# Altium project Melloband.PrjPcb
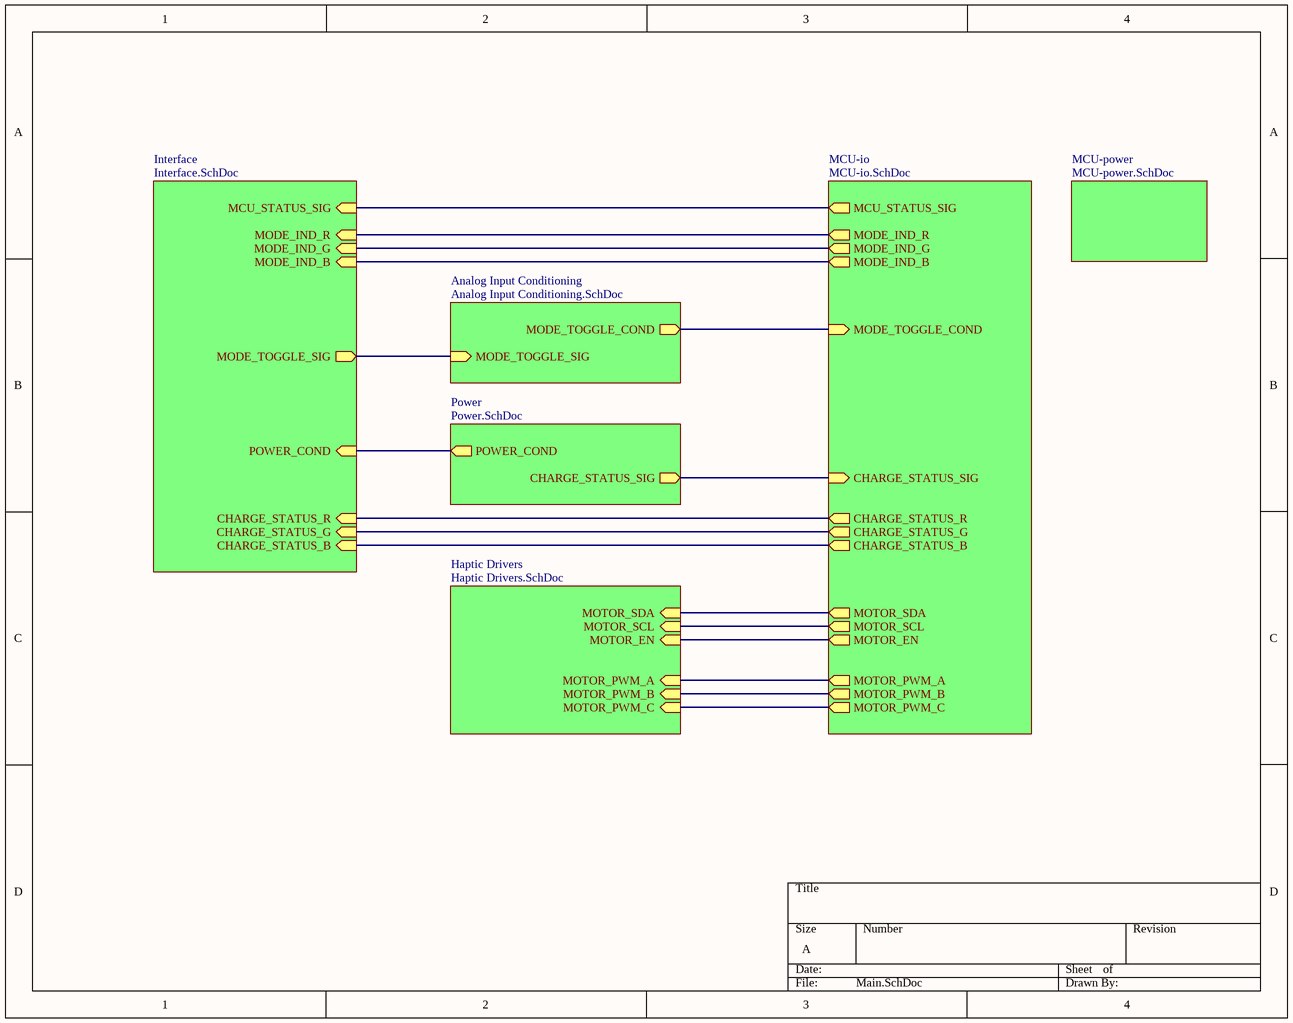
[diagram p0: Main.SchDoc]
7 sheets, 62 parts. Net scope: hierarchical (ports join the sheet entries above them; power ports are global).
Board file: PCB2.PcbDoc
Sheets:
  Main.SchDoc
    MCU-power = MCU-power.SchDoc
    Power = Power.SchDoc
    Analog Input Conditioning = Analog Input Conditioning.SchDoc
    Interface = Interface.SchDoc
    MCU-io = MCU-io.SchDoc
    Haptic Drivers = Haptic Drivers.SchDoc

## Sheet Main.SchDoc
size A; SheetNumber: 1; SheetTotal: 7

### Sub-sheets
Analog Input Conditioning = Analog Input Conditioning.SchDoc: MODE_TOGGLE_SIG (in), MODE_TOGGLE_COND (out)
Haptic Drivers = Haptic Drivers.SchDoc: MOTOR_SDA (in), MOTOR_SCL (in), MOTOR_EN (in), MOTOR_PWM_A (in), MOTOR_PWM_B (in), MOTOR_PWM_C (in)
Interface = Interface.SchDoc: MODE_TOGGLE_SIG (out), CHARGE_STATUS_B (in), MODE_IND_R (in), MCU_STATUS_SIG (in), POWER_COND (in), MODE_IND_G (in), MODE_IND_B (in), CHARGE_STATUS_G (in), CHARGE_STATUS_R (in)
MCU-io = MCU-io.SchDoc: MODE_IND_R (out), MODE_TOGGLE_COND (in), MCU_STATUS_SIG (out), CHARGE_STATUS_SIG (in), CHARGE_STATUS_R (out), MODE_IND_G (out), MODE_IND_B (out), CHARGE_STATUS_G (out), CHARGE_STATUS_B (out), MOTOR_SDA (out), MOTOR_SCL (out), MOTOR_EN (out), MOTOR_PWM_A (out), MOTOR_PWM_B (out), MOTOR_PWM_C (out)
MCU-power = MCU-power.SchDoc: no entries
Power = Power.SchDoc: CHARGE_STATUS_SIG (out), POWER_COND (out)

### Nets
CHARGE_STATUS: sheet Power/CHARGE_STATUS_SIG, sheet MCU-io/CHARGE_STATUS_SIG
CHARGE_STATUS_B: sheet Interface/CHARGE_STATUS_B, sheet MCU-io/CHARGE_STATUS_B
CHARGE_STATUS_G: sheet Interface/CHARGE_STATUS_G, sheet MCU-io/CHARGE_STATUS_G
CHARGE_STATUS_R: sheet Interface/CHARGE_STATUS_R, sheet MCU-io/CHARGE_STATUS_R
MCU_STATUS_SIG: sheet Interface/MCU_STATUS_SIG, sheet MCU-io/MCU_STATUS_SIG
MODE_IND_B: sheet Interface/MODE_IND_B, sheet MCU-io/MODE_IND_B
MODE_IND_G: sheet Interface/MODE_IND_G, sheet MCU-io/MODE_IND_G
MODE_IND_R: sheet Interface/MODE_IND_R, sheet MCU-io/MODE_IND_R
MODE_TOGGLE_COND: sheet Analog Input Conditioning/MODE_TOGGLE_COND, sheet MCU-io/MODE_TOGGLE_COND
MOTOR_EN: sheet MCU-io/MOTOR_EN, sheet Haptic Drivers/MOTOR_EN
MOTOR_PWM_A: sheet MCU-io/MOTOR_PWM_A, sheet Haptic Drivers/MOTOR_PWM_A
MOTOR_PWM_B: sheet MCU-io/MOTOR_PWM_B, sheet Haptic Drivers/MOTOR_PWM_B
MOTOR_PWM_C: sheet MCU-io/MOTOR_PWM_C, sheet Haptic Drivers/MOTOR_PWM_C
MOTOR_SCL: sheet MCU-io/MOTOR_SCL, sheet Haptic Drivers/MOTOR_SCL
MOTOR_SDA: sheet MCU-io/MOTOR_SDA, sheet Haptic Drivers/MOTOR_SDA
NetC17_2: sheet Power/POWER_COND, sheet Interface/POWER_COND
NetR4_1: sheet Analog Input Conditioning/MODE_TOGGLE_SIG, sheet Interface/MODE_TOGGLE_SIG

## Sheet MCU-power.SchDoc
size A; SheetNumber: 6; SheetTotal: 7
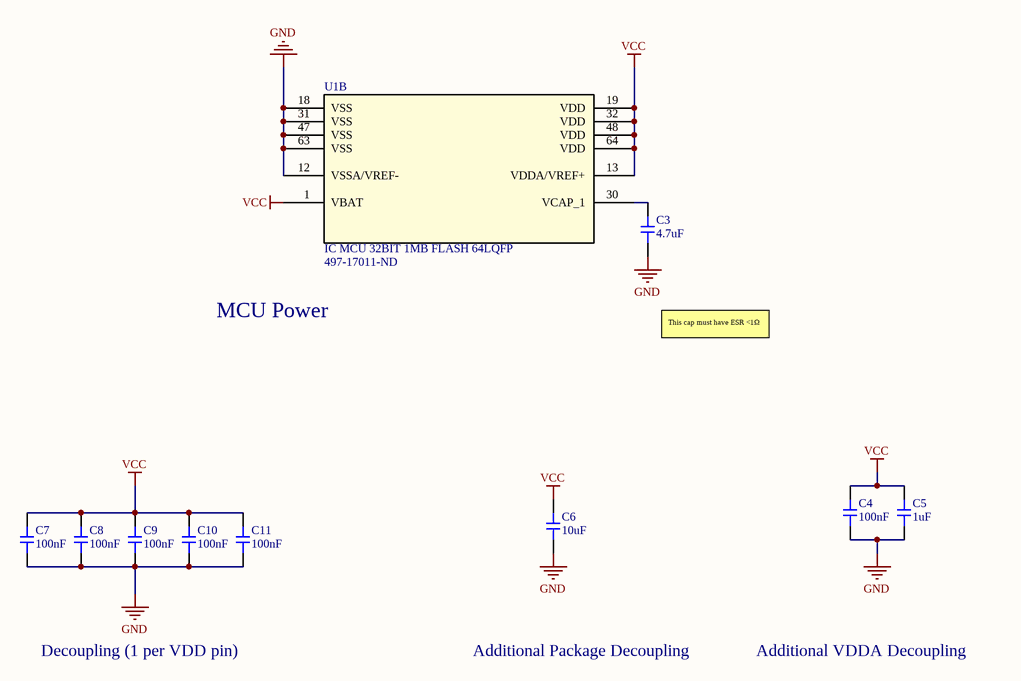
[diagram p1: MCU-power.SchDoc]

### Parts
C3  Capacitance: 4.7uF  [CAP-0603]  (hidden comment: CL10A475KO8NNNC)
C4  Capacitance: 100nF  [CAP-0603]  (hidden comment: CC0603KRX7R9BB104)
C5  Capacitance: 1uF  [CAP-0603]  (hidden comment: CL10A105KB8NNNC)
C6  Capacitance: 10uF  [CAP-0603]  (hidden comment: CL10A106KP8NNNC)
C7  Capacitance: 100nF  [CAP-0603]  (hidden comment: CC0603KRX7R9BB104)
C8  Capacitance: 100nF  [CAP-0603]  (hidden comment: CC0603KRX7R9BB104)
C9  Capacitance: 100nF  [CAP-0603]  (hidden comment: CC0603KRX7R9BB104)
C10  Capacitance: 100nF  [CAP-0603]  (hidden comment: CC0603KRX7R9BB104)
C11  Capacitance: 100nF  [CAP-0603]  (hidden comment: CC0603KRX7R9BB104)
U1  IC MCU 32BIT 1MB FLASH 64LQFP  Supplier Part Number 1: 497-17011-ND  [LQFP64-10x10mm]  (part B of 2)

### Nets
GND: C3.1 C4.1 C5.1 C6.1 C7.1 C8.1 C9.1 C10.1 C11.1 U1.12(VSSA/VREF-) U1.18(VSS) U1.31(VSS) U1.47(VSS) U1.63(VSS)
VCC: C4.2 C5.2 C6.2 C7.2 C8.2 C9.2 C10.2 C11.2 U1.1(VBAT) U1.13(VDDA/VREF+) U1.19(VDD) U1.32(VDD) U1.48(VDD) U1.64(VDD)
NetC3_2: C3.2 U1.30(VCAP_1)

### Notes on the sheet
- MCU Power
- This cap must have ESR <1Ω
- Decoupling (1 per VDD pin)
- Additional Package Decoupling
- Additional VDDA Decoupling

### Library data of the parts
C3 = CL10A475KO8NNNC: Capacitor, Ceramic (MLCC), 4.7uF, ±10%, 16V, X5R, ±10%, SMD 0603; Manufacturer: Samsung Electro-Mechanics; Temperature Rating: -55°C ~ 85°C; Capacitance @ 1V DC Bias: 4.097uF; Capacitance @ 1.2V DC Bias: 4.030uF; Capacitance @ 1.35V DC Bias: 3.972uF; Capacitance @ 1.5V DC Bias: 3.908uF; Capacitance @ 1.8V DC Bias: 3.769uF; Capacitance @ 2.5V DC Bias: 3.406uF; Capacitance @ 3.3V DC Bias: 2.969uF; Capacitance @ 3.7V DC Bias: 2.760uF; Capacitance @ 4.2V DC Bias: 2.508uF; Capacitance @ 5V DC Bias: 2.138uF; Capacitance @ 9V DC Bias: 1.155uF; Capacitance @ 12V DC Bias: 0.873uF; Capacitance @ 15V DC Bias: 0.647uF; Impedance (0V Bias) @ 100Hz: 437Ω; Impedance (0V Bias) @ 500Hz: 90.6Ω; Impedance (0V Bias) @ 1kHz: 46Ω; Impedance (0V Bias) @ 5kHz: 9.51Ω; Impedance (0V Bias) @ 10kHz: 4.83Ω; Impedance (0V Bias) @ 50kHz: 0.996Ω; Impedance (0V Bias) @ 100kHz: 0.505Ω; Impedance (0V Bias) @ 500kHz: 0.104Ω; Impedance (0V Bias) @ 1MHz: 0.05Ω; Impedance (0V Bias) @ 5MHz: 0.011Ω; Impedance (0V Bias) @ 10MHz: 0.0248Ω; Impedance (0V Bias) @ 50MHz: 0.0811Ω; Impedance (0V Bias) @ 100MHz: 0.141Ω; Impedance (0V Bias) @ 500MHz: 0.57Ω; Impedance (0V Bias) @ 1GHz: 1.02Ω; Impedance (0V Bias) @ 2GHz: 2.37Ω; Impedance (0V Bias) @ 5GHz: 4.65Ω; Impedance (16V Bias) @ 100Hz: 3.74E+03Ω; Impedance (16V Bias) @ 500Hz: 758Ω; Impedance (16V Bias) @ 1kHz: 381Ω; Impedance (16V Bias) @ 5kHz: 77.1Ω; Impedance (16V Bias) @ 10kHz: 38.7Ω; Impedance (16V Bias) @ 50kHz: 7.82Ω; Impedance (16V Bias) @ 100kHz: 3.93Ω; Impedance (16V Bias) @ 500kHz: 0.79Ω; Impedance (16V Bias) @ 1MHz: 0.386Ω; Impedance (16V Bias) @ 5MHz: 0.077Ω; Impedance (16V Bias) @ 10MHz: 0.0173Ω; Impedance (16V Bias) @ 50MHz: 0.0836Ω; Impedance (16V Bias) @ 100MHz: 0.142Ω; Impedance (16V Bias) @ 500MHz: 0.585Ω; Impedance (16V Bias) @ 1GHz: 1.06Ω; Impedance (16V Bias) @ 2GHz: 2.36Ω; Impedance (16V Bias) @ 5GHz: 4.63Ω; Package Size: 0603; JLCPCB Basic Part: Yes; JLCPCB Part Number: C19666; Supplier 1: LCSC; Category: Capacitors - MLCC; Supplier Part Number 1: C19666; Manufacturer Part Number: CL10A475KO8NNNC; Tolerance: ±10%; Voltage Rating: 16V; Temperature Coefficient: X5R; RoHS: Yes; ComponentLink1Description: Datasheet; ComponentLink1URL: https://wmsc.lcsc.com/wmsc/upload/file/pdf/v2/lcsc/2304140030_Samsung-Electro-Mechanics-CL10A475KO8NNNC_C19666.pdf; ComponentLink2Description: JLCPCB Part URL; ComponentLink2URL: https://jlcpcb.com/partdetail/C19666; ComponentLink3Description: LCSC Part URL; ComponentLink3URL: https://lcsc.com/product-detail/Multilayer-Ceramic-Capacitors-MLCC---SMD-SMT_Samsung-Electro-Mechanics-Samsung-Electro-Mechanics-CL10A475KO8NNNC_C19666.html; ComponentLink4Description: Samsung Component Library; ComponentLink4URL: https://weblib.samsungsem.com/mlcc/mlcc-ec.do?partNumber=CL10A475KO8NNN
C4 C7-C11 = CC0603KRX7R9BB104: Capacitor, Ceramic (MLCC), 100nF, ±10%, 50V, X7R, ±10%, SMD 0603; Manufacturer: YAGEO; Package Size: 0603; JLCPCB Basic Part: Yes; JLCPCB Part Number: C14663; Supplier 1: LCSC; Category: Capacitors - MLCC; Supplier Part Number 1: C14663; Manufacturer Part Number: CC0603KRX7R9BB104; Tolerance: ±10%; Voltage Rating: 50V; Temperature Coefficient: X7R; RoHS: Yes; ComponentLink1Description: Datasheet; ComponentLink1URL: https://wmsc.lcsc.com/wmsc/upload/file/pdf/v2/lcsc/2211101700_YAGEO-CC0603KRX7R9BB104_C14663.pdf; ComponentLink2Description: JLCPCB Part URL; ComponentLink2URL: https://jlcpcb.com/partdetail/C14663; ComponentLink3Description: LCSC Part URL; ComponentLink3URL: https://lcsc.com/product-detail/Multilayer-Ceramic-Capacitors-MLCC---SMD-SMT_YAGEO-YAGEO-CC0603KRX7R9BB104_C14663.html
C5 = CL10A105KB8NNNC: Capacitor, Ceramic (MLCC), 1uF, ±10%, 50V, X5R, ±10%, SMD 0603; Manufacturer: Samsung Electro-Mechanics; Temperature Rating: -55°C ~ 85°C; Capacitance @ 1V DC Bias: 1.054uF; Capacitance @ 1.2V DC Bias: 1.044uF; Capacitance @ 1.35V DC Bias: 1.035uF; Capacitance @ 1.5V DC Bias: 1.027uF; Capacitance @ 1.8V DC Bias: 1.007uF; Capacitance @ 2.5V DC Bias: 0.947uF; Capacitance @ 3.3V DC Bias: 0.865uF; Capacitance @ 3.7V DC Bias: 0.824uF; Capacitance @ 4.2V DC Bias: 0.773uF; Capacitance @ 5V DC Bias: 0.695uF; Capacitance @ 9V DC Bias: 0.410uF; Capacitance @ 12V DC Bias: 0.308uF; Capacitance @ 15V DC Bias: 0.231uF; Capacitance @ 24V DC Bias: 0.130uF; Capacitance @ 36V DC Bias: 0.080uF; Capacitance @ 48V DC Bias: 0.063uF; Impedance (0V Bias) @ 100Hz: 1.84E+03Ω; Impedance (0V Bias) @ 500Hz: 378Ω; Impedance (0V Bias) @ 1kHz: 191Ω; Impedance (0V Bias) @ 5kHz: 39.1Ω; Impedance (0V Bias) @ 10kHz: 19.8Ω; Impedance (0V Bias) @ 50kHz: 4.04Ω; Impedance (0V Bias) @ 100kHz: 2.04Ω; Impedance (0V Bias) @ 500kHz: 0.416Ω; Impedance (0V Bias) @ 1MHz: 0.208Ω; Impedance (0V Bias) @ 5MHz: 0.0293Ω; Impedance (0V Bias) @ 10MHz: 0.0159Ω; Impedance (0V Bias) @ 50MHz: 0.0822Ω; Impedance (0V Bias) @ 100MHz: 0.14Ω; Impedance (0V Bias) @ 500MHz: 0.54Ω; Impedance (0V Bias) @ 1GHz: 0.988Ω; Impedance (0V Bias) @ 2GHz: 2.38Ω; Impedance (0V Bias) @ 5GHz: 4.94Ω; Package Size: 0603; JLCPCB Basic Part: Yes; JLCPCB Part Number: C15849; Supplier 1: LCSC; Category: Capacitors - MLCC; Supplier Part Number 1: C15849; Manufacturer Part Number: CL10A105KB8NNNC; Tolerance: ±10%; Voltage Rating: 50V; Temperature Coefficient: X5R; RoHS: Yes; ComponentLink1Description: Datasheet; ComponentLink1URL: https://wmsc.lcsc.com/wmsc/upload/file/pdf/v2/lcsc/2304140030_Samsung-Electro-Mechanics-CL10A105KB8NNNC_C15849.pdf; ComponentLink2Description: JLCPCB Part URL; ComponentLink2URL: https://jlcpcb.com/partdetail/C15849; ComponentLink3Description: LCSC Part URL; ComponentLink3URL: https://lcsc.com/product-detail/Multilayer-Ceramic-Capacitors-MLCC---SMD-SMT_Samsung-Electro-Mechanics-Samsung-Electro-Mechanics-CL10A105KB8NNNC_C15849.html; ComponentLink4Description: Samsung Component Library; ComponentLink4URL: https://weblib.samsungsem.com/mlcc/mlcc-ec.do?partNumber=CL10A105KB8NNN
C6 = CL10A106KP8NNNC: Capacitor, Ceramic (MLCC), 10uF, ±10%, 10V, X5R, ±10%, SMD 0603; Manufacturer: Samsung Electro-Mechanics; Temperature Rating: -55°C ~ 85°C; Capacitance @ 1V DC Bias: 8.451uF; Capacitance @ 1.2V DC Bias: 8.084uF; Capacitance @ 1.35V DC Bias: 7.793uF; Capacitance @ 1.5V DC Bias: 7.497uF; Capacitance @ 1.8V DC Bias: 6.915uF; Capacitance @ 2.5V DC Bias: 5.691uF; Capacitance @ 3.3V DC Bias: 4.464uF; Capacitance @ 3.7V DC Bias: 3.996uF; Capacitance @ 4.2V DC Bias: 3.516uF; Capacitance @ 5V DC Bias: 2.897uF; Capacitance @ 9V DC Bias: 1.372uF; Impedance (0V Bias) @ 100Hz: 217Ω; Impedance (0V Bias) @ 500Hz: 44.6Ω; Impedance (0V Bias) @ 1kHz: 22.6Ω; Impedance (0V Bias) @ 5kHz: 4.64Ω; Impedance (0V Bias) @ 10kHz: 2.35Ω; Impedance (0V Bias) @ 50kHz: 0.481Ω; Impedance (0V Bias) @ 100kHz: 0.243Ω; Impedance (0V Bias) @ 500kHz: 0.0484Ω; Impedance (0V Bias) @ 1MHz: 0.0217Ω; Impedance (0V Bias) @ 5MHz: 0.0144Ω; Impedance (0V Bias) @ 10MHz: 0.0227Ω; Impedance (0V Bias) @ 50MHz: 0.0729Ω; Impedance (0V Bias) @ 100MHz: 0.123Ω; Impedance (0V Bias) @ 500MHz: 0.439Ω; Impedance (0V Bias) @ 1GHz: 0.788Ω; Impedance (0V Bias) @ 2GHz: 1.8Ω; Impedance (0V Bias) @ 5GHz: 3.33Ω; Impedance (10V Bias) @ 100Hz: 1.6E+03Ω; Impedance (10V Bias) @ 500Hz: 323Ω; Impedance (10V Bias) @ 1kHz: 162Ω; Impedance (10V Bias) @ 5kHz: 32.7Ω; Impedance (10V Bias) @ 10kHz: 16.4Ω; Impedance (10V Bias) @ 50kHz: 3.3Ω; Impedance (10V Bias) @ 100kHz: 1.66Ω; Impedance (10V Bias) @ 500kHz: 0.331Ω; Impedance (10V Bias) @ 1MHz: 0.161Ω; Impedance (10V Bias) @ 5MHz: 0.0215Ω; Impedance (10V Bias) @ 10MHz: 0.0228Ω; Impedance (10V Bias) @ 50MHz: 0.0759Ω; Impedance (10V Bias) @ 500MHz: 0.443Ω; Impedance (10V Bias) @ 1GHz: 0.786Ω; Impedance (10V Bias) @ 2GHz: 1.77Ω; Impedance (10V Bias) @ 5GHz: 3.28Ω; Package Size: 0603; JLCPCB Basic Part: Yes; JLCPCB Part Number: C19702; Supplier 1: LCSC; Category: Capacitors - MLCC; Supplier Part Number 1: C19702; Manufacturer Part Number: CL10A106KP8NNNC; Tolerance: ±10%; Voltage Rating: 10V; Temperature Coefficient: X5R; RoHS: Yes; ComponentLink1Description: Datasheet; ComponentLink1URL: https://wmsc.lcsc.com/wmsc/upload/file/pdf/v2/lcsc/2304140030_Samsung-Electro-Mechanics-CL10A106KP8NNNC_C19702.pdf; ComponentLink2Description: JLCPCB Part URL; ComponentLink2URL: https://jlcpcb.com/partdetail/C19702; ComponentLink3Description: LCSC Part URL; ComponentLink3URL: https://lcsc.com/product-detail/Multilayer-Ceramic-Capacitors-MLCC---SMD-SMT_Samsung-Electro-Mechanics-Samsung-Electro-Mechanics-CL10A106KP8NNNC_C19702.html; ComponentLink4Description: Samsung Component Library; ComponentLink4URL: https://weblib.samsungsem.com/mlcc/mlcc-ec.do?partNumber=CL10A106KP8NNN; Impedance (10V Bias) @ 100MHz: 0.123Ω
U1 = STM32F4xxR2_minimalist: ARM® Cortex®-M4 STM32F4 Microcontroller IC 32-Bit 100MHz 1MB (1M x 8) FLASH 64-LQFP (10x10); Vendor: STMicroelectronics; C: Copyright (C) 2016 Accelerated Designs. All rights reserved; Manufacturer_Part_Number: stm32f4xxr2; Copyright: Copyright (C) 2016 Accelerated Designs. All rights reserved; RefDes: RefDes; Type: Type; Value: Value; Supplier 1: Digi-Key

## Sheet Power.SchDoc
size A; SheetNumber: 2; SheetTotal: 7
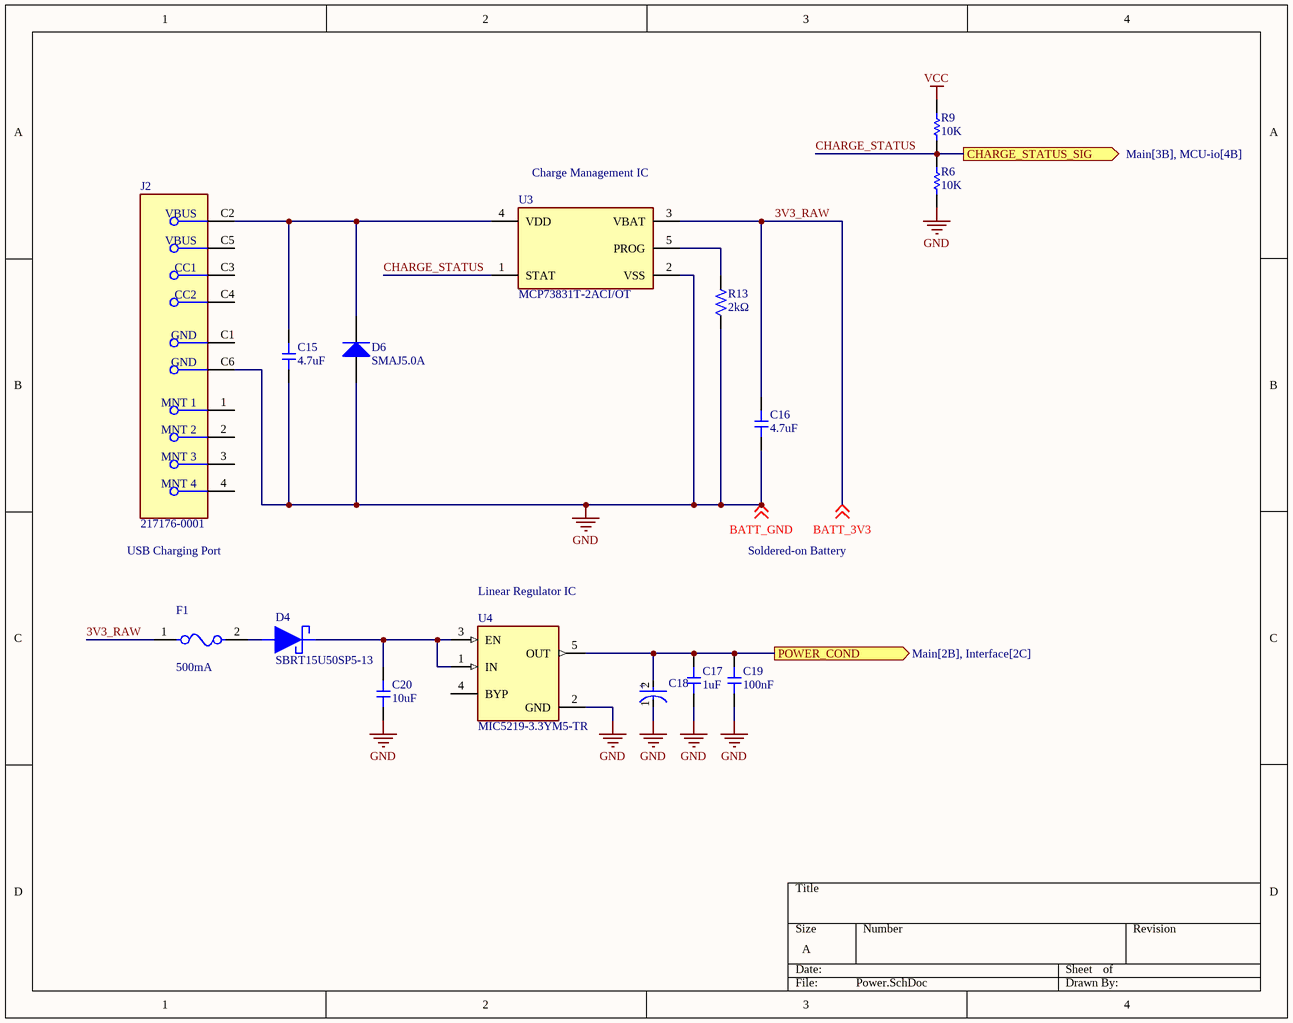
[diagram p2: Power.SchDoc]

### Parts
C15  Capacitance: 4.7uF  [CAP-0603]  (hidden comment: CL10A475KO8NNNC)
C16  Capacitance: 4.7uF  [CAP-0603]  (hidden comment: CL10A475KO8NNNC)
C17  Capacitance: 1uF  [CAP-0603]  (hidden comment: CL10A105KB8NNNC)
C18  293D106X9025B2TE3  [FP-293DB-MFG]  (value not drawn)
C19  Capacitance: 100nF  [CAP-0603]  (hidden comment: CC0603KRX7R9BB104)
C20  Capacitance: 10uF  [CAP-0603]  (hidden comment: CL10A106KP8NNNC)
D4  SBRT15U50SP5-13  [SBRT15U50SP5-13]
D6  SMAJ5.0A  [BOUR-SMA-2_V]
F1  500mA  [FP-0466-MFG]
J2  217176-0001  [FP-217176-0001-MFG]
R6  10K  [RES_SM0603_YAGEORC_N]
R9  10K  [RES_SM0603_YAGEORC_N]
R13  Resistance: 2kΩ  [RES-0603]  (hidden comment: 0603WAF2001T5E)
U3  MCP73831T-2ACI/OT  [FP-C04-091-OT-IPC_B]
U4  MIC5219-3.3YM5-TR  [FP-SOT23-5LD-PL-1-IPC_C]

### Ports
CHARGE_STATUS_SIG (out, see Main[3B], MCU-io[4B]), POWER_COND (out, see Main[2B], Interface[2C])

### Nets
GND: C15.1 C16.1 C17.1 C18.1(C) C19.1 C20.1 D6.1(A) J2.C6(GND) R6.1 R13.1 U3.2(VSS) U4.2(GND) ; off-sheet BATT_GND  [also labelled BATT_GND]
VCC: R9.2
3V3_RAW: C16.2 F1.1 U3.3(VBAT) ; off-sheet BATT_3V3  [also labelled BATT_3V3]
CHARGE_STATUS: R6.2 R9.1 U3.1(STAT) ; port CHARGE_STATUS_SIG
NetC15_2: C15.2 D6.2(K) J2.C2(VBUS) U3.4(VDD)
NetC17_2: C17.2 C18.2(A) C19.2 U4.5(OUT) ; port POWER_COND
NetC20_2: C20.2 D4.2 U4.1(IN) U4.3(EN)
NetD4_1: D4.1 F1.2
NetR13_2: R13.2 U3.5(PROG)

Not connected (* = marked no-connect by the designer): J2 1(MNT_1) 2(MNT_2) 3(MNT_3) 4(MNT_4) C1(GND) C3(CC1) C4(CC2) C5(VBUS); U4 4(BYP)

### Notes on the sheet
- (near U3) Charge Management IC
- USB Charging Port
- Soldered-on Battery
- (near U4) Linear Regulator IC
- (in symbol CMP-02414-000016-1) +

### Library data of the parts
C15 C16 = CL10A475KO8NNNC: as C3 on sheet MCU-power; Package Size: 0603; JLCPCB Basic Part: Yes; JLCPCB Part Number: C19666; Supplier 1: LCSC; Category: Capacitors - MLCC; Supplier Part Number 1: C19666; Manufacturer Part Number: CL10A475KO8NNNC; Tolerance: ±10%; Voltage Rating: 16V; Temperature Coefficient: X5R; RoHS: Yes; ComponentLink1Description: Datasheet; ComponentLink1URL: https://wmsc.lcsc.com/wmsc/upload/file/pdf/v2/lcsc/2304140030_Samsung-Electro-Mechanics-CL10A475KO8NNNC_C19666.pdf; ComponentLink2Description: JLCPCB Part URL; ComponentLink2URL: https://jlcpcb.com/partdetail/C19666; ComponentLink3Description: LCSC Part URL; ComponentLink3URL: https://lcsc.com/product-detail/Multilayer-Ceramic-Capacitors-MLCC---SMD-SMT_Samsung-Electro-Mechanics-Samsung-Electro-Mechanics-CL10A475KO8NNNC_C19666.html; ComponentLink4Description: Samsung Component Library; ComponentLink4URL: https://weblib.samsungsem.com/mlcc/mlcc-ec.do?partNumber=CL10A475KO8NNN
C17 = CL10A105KB8NNNC: as C5 on sheet MCU-power; Package Size: 0603; JLCPCB Basic Part: Yes; JLCPCB Part Number: C15849; Supplier 1: LCSC; Category: Capacitors - MLCC; Supplier Part Number 1: C15849; Manufacturer Part Number: CL10A105KB8NNNC; Tolerance: ±10%; Voltage Rating: 50V; Temperature Coefficient: X5R; RoHS: Yes; ComponentLink1Description: Datasheet; ComponentLink1URL: https://wmsc.lcsc.com/wmsc/upload/file/pdf/v2/lcsc/2304140030_Samsung-Electro-Mechanics-CL10A105KB8NNNC_C15849.pdf; ComponentLink2Description: JLCPCB Part URL; ComponentLink2URL: https://jlcpcb.com/partdetail/C15849; ComponentLink3Description: LCSC Part URL; ComponentLink3URL: https://lcsc.com/product-detail/Multilayer-Ceramic-Capacitors-MLCC---SMD-SMT_Samsung-Electro-Mechanics-Samsung-Electro-Mechanics-CL10A105KB8NNNC_C15849.html; ComponentLink4Description: Samsung Component Library; ComponentLink4URL: https://weblib.samsungsem.com/mlcc/mlcc-ec.do?partNumber=CL10A105KB8NNN
C18 = CMP-02414-000016-1: TANTALUM CAP 10000000 PF 10%; Capacitance: 10uF; Dissipation Factor: 6%; ESR (Equivalent Series Resistance): 2.3R; Polarity: Polar; Voltage Rating: 25V; Voltage Rating (DC): 200kV; Leakage Current: 2.5uA; Ripple Current: 190mA; Case Code (Metric): 3528; Width: 1.9mm; Height: 2.1mm; Radiation Hardening: No; Dielectric Material: Tantalum; Weight: 0.002293oz; RoHS Compliant: Yes; Min Operating Temperature: -55°C; Max Operating Temperature: 125°C; Length: 3.5mm; Packaging: Tape and Reel; Lead Free: Lead Free; Series: 293D; Package Quantity: 2000; Case Code (Imperial): 1411; Tolerance: 10%; Termination: SMD/SMT; Depth: 2.8mm; Case/Package: Molded
C19 = CC0603KRX7R9BB104: as C4 on sheet MCU-power; Package Size: 0603; JLCPCB Basic Part: Yes; JLCPCB Part Number: C14663; Supplier 1: LCSC; Category: Capacitors - MLCC; Supplier Part Number 1: C14663; Manufacturer Part Number: CC0603KRX7R9BB104; Tolerance: ±10%; Voltage Rating: 50V; Temperature Coefficient: X7R; RoHS: Yes; ComponentLink1Description: Datasheet; ComponentLink1URL: https://wmsc.lcsc.com/wmsc/upload/file/pdf/v2/lcsc/2211101700_YAGEO-CC0603KRX7R9BB104_C14663.pdf; ComponentLink2Description: JLCPCB Part URL; ComponentLink2URL: https://jlcpcb.com/partdetail/C14663; ComponentLink3Description: LCSC Part URL; ComponentLink3URL: https://lcsc.com/product-detail/Multilayer-Ceramic-Capacitors-MLCC---SMD-SMT_YAGEO-YAGEO-CC0603KRX7R9BB104_C14663.html
C20 = CL10A106KP8NNNC: as C6 on sheet MCU-power; Package Size: 0603; JLCPCB Basic Part: Yes; JLCPCB Part Number: C19702; Supplier 1: LCSC; Category: Capacitors - MLCC; Supplier Part Number 1: C19702; Manufacturer Part Number: CL10A106KP8NNNC; Tolerance: ±10%; Voltage Rating: 10V; Temperature Coefficient: X5R; RoHS: Yes; ComponentLink1Description: Datasheet; ComponentLink1URL: https://wmsc.lcsc.com/wmsc/upload/file/pdf/v2/lcsc/2304140030_Samsung-Electro-Mechanics-CL10A106KP8NNNC_C19702.pdf; ComponentLink2Description: JLCPCB Part URL; ComponentLink2URL: https://jlcpcb.com/partdetail/C19702; ComponentLink3Description: LCSC Part URL; ComponentLink3URL: https://lcsc.com/product-detail/Multilayer-Ceramic-Capacitors-MLCC---SMD-SMT_Samsung-Electro-Mechanics-Samsung-Electro-Mechanics-CL10A106KP8NNNC_C19702.html; ComponentLink4Description: Samsung Component Library; ComponentLink4URL: https://weblib.samsungsem.com/mlcc/mlcc-ec.do?partNumber=CL10A106KP8NNN; Impedance (10V Bias) @ 100MHz: 0.123Ω
D4 = SBRT15U50SP5-13: Reverse Polarity Protection; Manufacturer: Diodes Incorporated; Diode Type: Super Barrier; Current - Average Rectified (Io): 15A; Speed: Fast Recovery =< 500ns, > 200mA (Io); Supplier 1: Digi-Key; Supplier Part Number 1: SBRT15U50SP5-13DICT-ND; Manufacturer Part Number: SBRT15U50SP5-13; RoHS: RoHS Compliant; Category: Discrete Semiconductor Products; Stock 1: 12134; Pricing 1: 1=0.93, 10=0.823, 100=0.6306, 500=0.49852, 1000=0.39882 (USD); Packaging: Cut Tape (CT); Part Status: Active; Capacitance @ Vr, F: -; Mounting Type: Surface Mount; Package / Case: PowerDI™ 5; Supplier Device Package: PowerDI®5; Operating Temperature - Junction: -65°C ~ 150°C; ComponentLink1URL: https://media.digikey.com/pdf/Data%20Sheets/Diodes%20PDFs/SBRT15U50SP5.pdf; ComponentLink1Description: https://media.digikey.com/pdf/Data%20Sheets/Diodes%20PDFs/SBRT15U50SP5.pdf
D6 = CMP-2000-07090-1: SMAJ Transient Voltage Suppressor Diode Series, 3.5 V, -55 to 150 degC, 2-Pin SMA, RoHS, Tape and Reel; Manufacturer: Bourns; EDA / CAD Models: DownloadfromAcceleratedDesigns; Unidirectional Channels: 1; Voltage - Breakdown (Min): 6.4V; Voltage - Reverse Standoff (Typ): 5V; Voltage - Clamping (Max) @ Ipp: 9.2V; Other Names: SMAJ5.0ABDKR; Type: Zener; Catalog Drawings: SMAJSeriesFootprintSMAJ,SMBJSeries; Featured Product: SMAJ/SMBJ/SMCJ/SMLJDiscreteTVSDiodes; Power - Peak Pulse: 400W; Current - Peak Pulse (10/1000µs): 43.5A; Power Line Protection: No; Online Catalog: SMAJSeries; Supplier Device Package: SMA(DO-214AC); Operating Temperature: -55°C~150°C(TJ); Package Description: 2-Pin Surface Mount Device, Body 4.315 x 2.605 mm; Datasheet URL: https://datasheet.ciiva.com/25624/0900766b8112213b-25624680.pdf; Manufacturer URL: http://www.bourns.com/; Datasheet Version: 08/2012; Series: SMAJ; Family: TVS-Diodes; Bidirectional Channels: -; Applications: GeneralPurpose; Package Reference: SMA-2; Standard Package: 1; Package / Case: DO-214AC,SMA; Category: CircuitProtection; RoHS Information: SMAJSeriesMaterialDeclaration; Mounting Technology: SurfaceMount; Capacitance @ Frequency: -; Packaging: Digi-Reel®; Mounting Type: SurfaceMount
F1 = 0466.500NR: 500mA Fuse; Manufacturer: Littelfuse Inc; Manufacturer: Littelfuse; Fuse Voltage Drop: 158.47mV; Voltage Rating: 63V; Fuse Interrupt Dc Current: 50A; Fuse Blow Speed: Fast; Fuse I2T: 0.006A2Sec; Resistance: 0.248Ω; Value: 0.248Ω; Fuse Current: 0.5A; Manufacturer Part Number: 0466.500NR; Digikey Description: FUSE BOARD MOUNT 500MA 63VAC/VDC; Device Class L2: Fuses; Max Fuse Dc Voltage: 63V; Mouser Description: SMD Fuse 0.5 A Fast-Blow, 466 1206; Octopart: https://octopart.com/0466.500nr-littelfuse-566004; Temperature Range High: +90°C; Lead Free: Yes; Fuse Interrupt Ac Current: 50A; RoHS: TRUE; Device Class L1: Circuit Protection; Height: 0.66mm; Automotive: No; Category: Fuse; Temperature: -55°C to +90°C; Package: 0466; Device Class L3: unset; ComponentLink2URL: https://www.littelfuse.com/~/media/electronics/datasheets/fuses/littelfuse_fuse_466_datasheet.pdf.pdf; Max Fuse Ac Voltage: 63V; ComponentLink2Description: Datasheet; Temperature Range Low: -55°C
J2 = CMP-04767-000013-1: CONN RCPT TYPE C 24POS SMD RA
R6 R9 = RC0603FR-0710KL: RES 10K SM0603 YAGEO RC_L; Power (Watts): 0.1; Resistance (Ohms): 10000; Tolerance (%): 1; Category: Resistor; Manufacturer: Yageo; Manufacturer Part Number: RC0603FR-0710KL; Package: 0603; Value: 10K; Supplier Part Number 1: 9238603; Supplier 1: Farnell; ComponentLink1URL: http://www.yageo.com; ComponentLink1Description: Manufacturer Website; Supplier 2: Digi-Key; Supplier Part Number 2: 311-10.0KHRCT-ND
R13 = 0603WAF2001T5E: Resistor, 2kΩ, ±1%, 100mW, 75V, ±100ppm/℃, -55℃~+155℃, SMD 0603; Manufacturer: Uniroyal; Supplier 1: LCSC; Manufacturer Part Number: 0603WAF2001T5E; Supplier Part Number 1: C22975; JLCPCB Part Number: C22975; Power Rating: 100mW; Category: Resistors; Package Size: 0603; JLCPCB Basic Part: Yes; Tolerance: ±1%; Voltage Rating: 75V; Temperature Coefficient: ±100ppm/℃; Temperature Rating: -55℃~+155℃; ComponentLink1Description: Datasheet; ComponentLink1URL: https://wmsc.lcsc.com/wmsc/upload/file/pdf/v2/lcsc/2206010116_UNI-ROYAL-Uniroyal-Elec-0603WAF2001T5E_C22975.pdf; ComponentLink2Description: JLCPCB Part URL; ComponentLink2URL: https://jlcpcb.com/partdetail/C22975
U3 = CMP-0133-00143-2: IC CONTROLLR LI-ION 4.2V SOT23-5; Max Power Dissipation: 1.54W; Output Current: 500mA; Max Output Voltage: 4.5V; Number of Outputs: 1; Min Output Voltage: 4.168V; Min Supply Voltage: 3.75V; Max Input Voltage: 6V; Voltage Rating: 4.534V; Drain to Source Resistance: 350mR; Max Operating Temperature: 85°C; Length: 0.122inch; Number of Pins: 5; REACH SVHC: No SVHC; Radiation Hardening: No; Min Operating Temperature: -40°C; Weight: 0.00709oz; Contact Plating: Tin; Termination: SMD/SMT; Case/Package: SOT-23; Mount: Surface Mount; Width: 0.071inch; Packaging: Tape and Reel; Number of Cells: 1; Max Charge Current: 500mA; Height: 0.051inch; Number of Channels: 1; Output Voltage: 4.2V; Max Supply Voltage: 6V; Lead Free: Lead Free
U4 = CMP-06324-000027-1: IC REG LINEAR 3.3V 500MA SOT23-5; Dropout Voltage: 350mV; Output Type: Fixed; Number of Regulators: 1; Max Input Voltage: 12V; Min Input Voltage: 2.5V; Min Operating Temperature: -40°C; Nominal Output Voltage: 3.3V; Output Voltage: 3.3V; Packaging: Cut Tape; Mount: Surface Mount; Number of Pins: 5; Case/Package: SOT-23-5; Lead Free: Lead Free; Max Operating Temperature: 125°C; REACH SVHC: No SVHC; Output Current: 500mA

## Sheet Analog Input Conditioning.SchDoc
size A; SheetNumber: 3; SheetTotal: 7
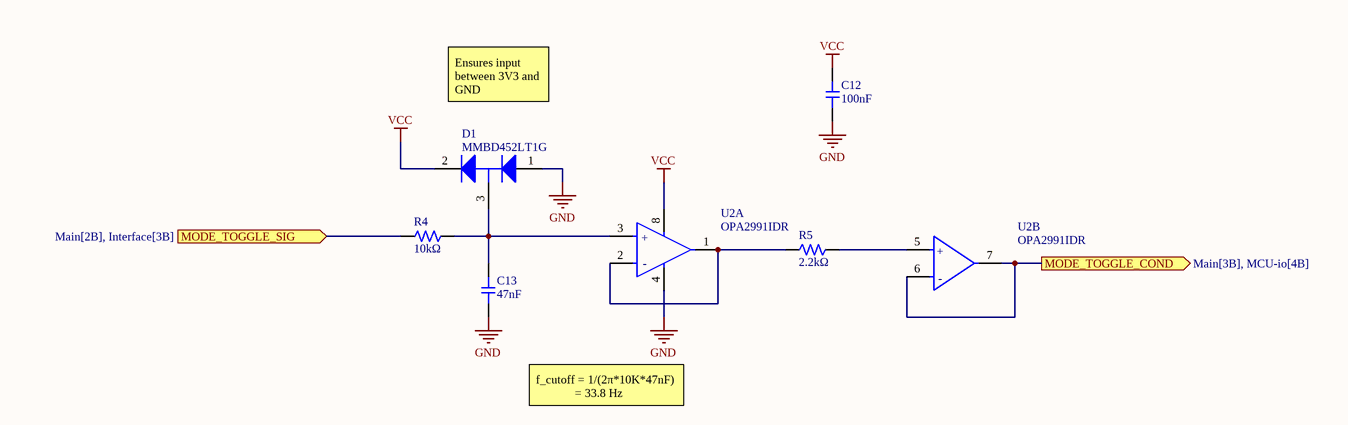
[diagram p3: Analog Input Conditioning.SchDoc]

### Parts
C12  Capacitance: 100nF  [CAP-0603]  (hidden comment: CC0603KRX7R9BB104)
C13  Capacitance: 47nF  [CAP-0603]  (hidden comment: CL10B473KB8NNNC)
D1  MMBD452LT1G  [ONSC-SOT-23-3-318-08_V]
R4  Resistance: 10kΩ  [RES-0603]  (hidden comment: 0603WAF1002T5E)
R5  Resistance: 2.2kΩ  [RES-0603]  (hidden comment: 0603WAF2201T5E)
U2  OPA2991IDR  [FP-D0008A-IPC_C]  (parts A,B of 2)

### Ports
MODE_TOGGLE_COND (out, see Main[3B], MCU-io[4B]), MODE_TOGGLE_SIG (in, see Main[2B], Interface[3B])

### Nets
GND: C12.1 C13.1 D1.1(A) U2.4(V-)
VCC: C12.2 D1.2(K) U2.8(V+)
MODE_TOGGLE_COND: U2.6(IN2-) U2.7(OUT2) ; port MODE_TOGGLE_COND
NetC13_2: C13.2 D1.3(K/A) R4.2 U2.3(IN1+)
NetR4_1: R4.1 ; port MODE_TOGGLE_SIG
NetR5_1: R5.1 U2.1(OUT1) U2.2(IN1-)
NetR5_2: R5.2 U2.5(IN2+)

### Notes on the sheet
- Ensures input between 3V3 and GND
- f_cutoff = 1/(2π*10K*47nF)
  = 33.8 Hz
- (in symbol OPA2991IDR, part A) +; -
- (in symbol OPA2991IDR, part B) +; -

### Library data of the parts
C12 = CC0603KRX7R9BB104: as C4 on sheet MCU-power; Package Size: 0603; JLCPCB Basic Part: Yes; JLCPCB Part Number: C14663; Supplier 1: LCSC; Category: Capacitors - MLCC; Supplier Part Number 1: C14663; Manufacturer Part Number: CC0603KRX7R9BB104; Tolerance: ±10%; Voltage Rating: 50V; Temperature Coefficient: X7R; RoHS: Yes; ComponentLink1Description: Datasheet; ComponentLink1URL: https://wmsc.lcsc.com/wmsc/upload/file/pdf/v2/lcsc/2211101700_YAGEO-CC0603KRX7R9BB104_C14663.pdf; ComponentLink2Description: JLCPCB Part URL; ComponentLink2URL: https://jlcpcb.com/partdetail/C14663; ComponentLink3Description: LCSC Part URL; ComponentLink3URL: https://lcsc.com/product-detail/Multilayer-Ceramic-Capacitors-MLCC---SMD-SMT_YAGEO-YAGEO-CC0603KRX7R9BB104_C14663.html
C13 = CL10B473KB8NNNC: Capacitor, Ceramic (MLCC), 47nF, ±10%, 50V, X7R, ±10%, SMD 0603; Manufacturer: Samsung Electro-Mechanics; Temperature Rating: -55°C ~ 125°C; Capacitance @ 1V DC Bias: 47.231nF; Capacitance @ 1.2V DC Bias: 47.280nF; Capacitance @ 1.35V DC Bias: 47.319nF; Capacitance @ 1.5V DC Bias: 47.357nF; Capacitance @ 1.8V DC Bias: 47.426nF; Capacitance @ 2.5V DC Bias: 47.515nF; Capacitance @ 3.3V DC Bias: 47.532nF; Capacitance @ 3.7V DC Bias: 47.514nF; Capacitance @ 4.2V DC Bias: 47.475nF; Capacitance @ 5V DC Bias: 47.375nF; Capacitance @ 9V DC Bias: 46.446nF; Capacitance @ 12V DC Bias: 45.320nF; Capacitance @ 15V DC Bias: 44.061nF; Capacitance @ 24V DC Bias: 39.258nF; Capacitance @ 36V DC Bias: 31.412nF; Capacitance @ 48V DC Bias: 23.014nF; Impedance (0V Bias) @ 100Hz: 3.3E+04Ω; Impedance (0V Bias) @ 500Hz: 6.73E+03Ω; Impedance (0V Bias) @ 1kHz: 3.4E+03Ω; Impedance (0V Bias) @ 5kHz: 693Ω; Impedance (0V Bias) @ 10kHz: 349Ω; Impedance (0V Bias) @ 50kHz: 71.1Ω; Impedance (0V Bias) @ 100kHz: 35.7Ω; Impedance (0V Bias) @ 500kHz: 7.27Ω; Impedance (0V Bias) @ 1MHz: 3.65Ω; Impedance (0V Bias) @ 5MHz: 0.738Ω; Impedance (0V Bias) @ 10MHz: 0.364Ω; Impedance (0V Bias) @ 50MHz: 0.0607Ω; Impedance (0V Bias) @ 100MHz: 0.192Ω; Impedance (0V Bias) @ 500MHz: 0.928Ω; Impedance (0V Bias) @ 1GHz: 1.81Ω; Impedance (0V Bias) @ 2GHz: 4.68Ω; Impedance (0V Bias) @ 5GHz: 10.5Ω; Package Size: 0603; JLCPCB Basic Part: Yes; JLCPCB Part Number: C1622; Supplier 1: LCSC; Category: Capacitors - MLCC; Supplier Part Number 1: C1622; Manufacturer Part Number: CL10B473KB8NNNC; Tolerance: ±10%; Voltage Rating: 50V; Temperature Coefficient: X7R; RoHS: Yes; ComponentLink1Description: Datasheet; ComponentLink1URL: https://wmsc.lcsc.com/wmsc/upload/file/pdf/v2/lcsc/2304140030_Samsung-Electro-Mechanics-CL10B473KB8NNNC_C1622.pdf; ComponentLink2Description: JLCPCB Part URL; ComponentLink2URL: https://jlcpcb.com/partdetail/C1622; ComponentLink3Description: LCSC Part URL; ComponentLink3URL: https://lcsc.com/product-detail/Multilayer-Ceramic-Capacitors-MLCC---SMD-SMT_Samsung-Electro-Mechanics-Samsung-Electro-Mechanics-CL10B473KB8NNNC_C1622.html; ComponentLink4Description: Samsung Component Library; ComponentLink4URL: https://weblib.samsungsem.com/mlcc/mlcc-ec.do?partNumber=CL10B473KB8NNN
D1 = MMBD452LT1G: 30V SCHOTTKY; Manufacturer: On Semiconductor; Packing: Tape and Reel; Configuration: Dual; ComponentLink2Description: Datasheet; ComponentLink3URL: http://www.onsemi.cn/pub_link/Collateral/318-08.PDF; ComponentLink1URL: http://www.onsemi.com/; Mounting Technology: Surface Mount; ComponentLink3Description: Package Specification; PackageVersion: Rev. AP, 11/2009; PartNumber: MMBD452LT1G; ComponentLink1Description: Manufacturer URL; ComponentLink2URL: http://www.onsemi.cn/pub_link/Collateral/MMBD452LT1-D.PDF; PackageReference: SOT-23-3-318-08; RoHS: TRUE; PackageDescription: 3-Pin Small Outline Transistor, Body 2.92 x 1.3 mm, Pitch 0.95 mm; DatasheetVersion: Rev. 4; Manufacturer: ON Semiconductor; Manufacturer Part Number: MMBD452LT1G
R4 = 0603WAF1002T5E: Resistor, 10kΩ, ±1%, 100mW, 75V, ±100ppm/℃, -55℃~+155℃, SMD 0603; Manufacturer: Uniroyal; Supplier 1: LCSC; Manufacturer Part Number: 0603WAF1002T5E; Supplier Part Number 1: C25804; JLCPCB Part Number: C25804; Power Rating: 100mW; Category: Resistors; Package Size: 0603; JLCPCB Basic Part: Yes; Tolerance: ±1%; Voltage Rating: 75V; Temperature Coefficient: ±100ppm/℃; Temperature Rating: -55℃~+155℃; ComponentLink1Description: Datasheet; ComponentLink1URL: https://wmsc.lcsc.com/wmsc/upload/file/pdf/v2/lcsc/2206010045_UNI-ROYAL-Uniroyal-Elec-0603WAF1002T5E_C25804.pdf; ComponentLink2Description: JLCPCB Part URL; ComponentLink2URL: https://jlcpcb.com/partdetail/C25804
R5 = 0603WAF2201T5E: Resistor, 2.2kΩ, ±1%, 100mW, 75V, ±100ppm/℃, -55℃~+155℃, SMD 0603; Manufacturer: Uniroyal; Supplier 1: LCSC; Manufacturer Part Number: 0603WAF2201T5E; Supplier Part Number 1: C4190; JLCPCB Part Number: C4190; Power Rating: 100mW; Category: Resistors; Package Size: 0603; JLCPCB Basic Part: Yes; Tolerance: ±1%; Voltage Rating: 75V; Temperature Coefficient: ±100ppm/℃; Temperature Rating: -55℃~+155℃; ComponentLink1Description: Datasheet; ComponentLink1URL: https://wmsc.lcsc.com/wmsc/upload/file/pdf/v2/lcsc/2206010230_UNI-ROYAL-Uniroyal-Elec-0603WAF2201T5E_C4190.pdf; ComponentLink2Description: JLCPCB Part URL; ComponentLink2URL: https://jlcpcb.com/partdetail/C4190
U2 = OPA2991IDR: IC OPAMP GP 2 CIRCUIT 8SOIC; Manufacturer: Texas Instruments; Manufacturer Part Number: OPA2991IDR

## Sheet Interface.SchDoc
size A; SheetNumber: 4; SheetTotal: 7
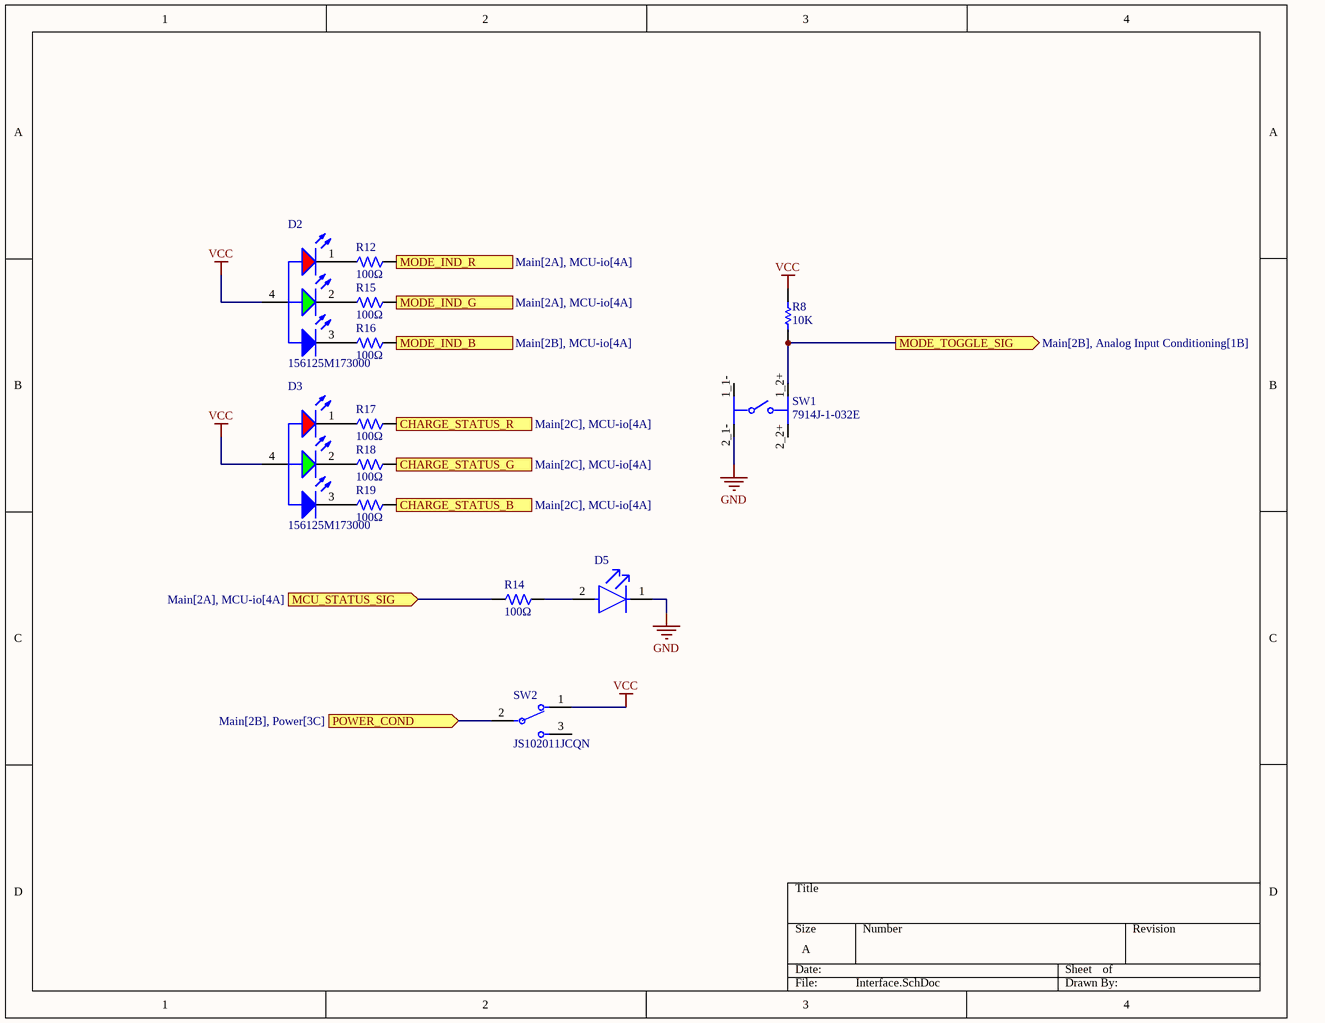
[diagram p4: Interface.SchDoc]

### Parts
D2  156125M173000  [WL-SFRW_1205_reverse use]
D3  156125M173000  [WL-SFRW_1205_reverse use]
D5  LTST-C193TBKT-5A  [FP-LTST-C193TBKT-5A-MFG]  (value not drawn)
R8  10K  [RES_SM0603_YAGEORC_N]
R12  Resistance: 100Ω  [RES-0603]  (hidden comment: 0603WAF1000T5E)
R14  Resistance: 100Ω  [RES-0603]  (hidden comment: 0603WAF1000T5E)
R15  Resistance: 100Ω  [RES-0603]  (hidden comment: 0603WAF1000T5E)
R16  Resistance: 100Ω  [RES-0603]  (hidden comment: 0603WAF1000T5E)
R17  Resistance: 100Ω  [RES-0603]  (hidden comment: 0603WAF1000T5E)
R18  Resistance: 100Ω  [RES-0603]  (hidden comment: 0603WAF1000T5E)
R19  Resistance: 100Ω  [RES-0603]  (hidden comment: 0603WAF1000T5E)
SW1  7914J-1-032E  [FP-7914J-1-032E-MFG]
SW2  JS102011JCQN  [FP-JS102011JCQN-MFG]

### Ports
CHARGE_STATUS_B (in, see Main[2C], MCU-io[4A]), CHARGE_STATUS_G (in, see Main[2C], MCU-io[4A]), CHARGE_STATUS_R (in, see Main[2C], MCU-io[4A]), MCU_STATUS_SIG (in, see Main[2A], MCU-io[4A]), MODE_IND_B (in, see Main[2B], MCU-io[4A]), MODE_IND_G (in, see Main[2A], MCU-io[4A]), MODE_IND_R (in, see Main[2A], MCU-io[4A]), MODE_TOGGLE_SIG (out, see Main[2B], Analog Input Conditioning[1B]), POWER_COND (in, see Main[2B], Power[3C])

### Nets
GND: D5.1(C) SW1.2_1-(2_1-)
VCC: D2.4(A) D3.4(A) R8.2 SW2.1
CHARGE_STATUS_B: R19.2 ; port CHARGE_STATUS_B
CHARGE_STATUS_G: R18.2 ; port CHARGE_STATUS_G
CHARGE_STATUS_R: R17.2 ; port CHARGE_STATUS_R
MCU_STATUS_SIG: R14.1 ; port MCU_STATUS_SIG
MODE_IND_B: R16.2 ; port MODE_IND_B
MODE_IND_G: R15.2 ; port MODE_IND_G
MODE_IND_R: R12.2 ; port MODE_IND_R
NetC17_2: SW2.2 ; port POWER_COND
NetD2_1: D2.1(K) R12.1
NetD2_2: D2.2(K) R15.1
NetD2_3: D2.3(K) R16.1
NetD3_1: D3.1(K) R17.1
NetD3_2: D3.2(K) R18.1
NetD3_3: D3.3(K) R19.1
NetD5_2: D5.2(A) R14.2
NetR4_1: R8.1 SW1.1_2+(1_2+) ; port MODE_TOGGLE_SIG

Not connected (* = marked no-connect by the designer): SW1 1_1-(1_1-) 2_2+(2_2+); SW2 3

### Library data of the parts
D2 D3 = CMP-207942-000006-2: LED RGB CLEAR 4SMD BOTTOM ENTRY; NexarPartId: 82270997; Max Reverse Voltage (DC): 5V; Color: Blue, Green, Red; Forward Current: 40mA; Viewing Angle: 120°; Luminous Intensity: 70mcd; Forward Voltage: 2V; Dominant Wavelength: 525nm; Power Dissipation: 48mW; Peak Wavelength: 468nm; Packaging: Tape and Reel; RoHS: Compliant; Reverse Voltage: 5V; Height: 800µm; Width: 1.2mm; Length: 3.2mm; Max Operating Temperature: 85°C; Min Operating Temperature: -40°C
D5 = CMP-2000-06624-2: LED BLUE CLEAR CHIP SMD; Number of Elements: 1; Forward Voltage: 2.8V; Forward Current: 20mA; Test Current: 5mA; Lens Color: Colorless; Dominant Wavelength: 475nm; Reverse Voltage: 5V; Viewing Angle: 130°; Lens Style: Diffused; Luminous Intensity: 15mcd; Power Dissipation: 76mW; Max Operating Temperature: 80°C; Length: 1.6mm; Number of LEDs: 1; Case/Package: 0603; Case Code (Metric): 1608; Number of Pins: 2; Radiation Hardening: No; Min Operating Temperature: -20°C; Width: 0.8mm; Packaging: Tape and Reel; Package Quantity: 1; Lead Free: Lead Free; Lens Transparency: Clear; Illumination Color: Blue; Color: Blue; RoHS Compliant: Yes; Mount: Surface Mount; Depth: 0.8mm; Case Code (Imperial): 0603; Height: 0.35mm
R8 = RC0603FR-0710KL: as R6 on sheet Power; Category: Resistor; Manufacturer: Yageo; Manufacturer Part Number: RC0603FR-0710KL; Package: 0603; Value: 10K; Supplier Part Number 1: 9238603; Supplier 1: Farnell; ComponentLink1URL: http://www.yageo.com; ComponentLink1Description: Manufacturer Website; Supplier 2: Digi-Key; Supplier Part Number 2: 311-10.0KHRCT-ND
R12 R14-R19 = 0603WAF1000T5E: Resistor, 100Ω, ±1%, 100mW, 75V, ±200ppm/℃, -55℃~+155℃, SMD 0603; Manufacturer: Uniroyal; Supplier 1: LCSC; Manufacturer Part Number: 0603WAF1000T5E; Supplier Part Number 1: C22775; JLCPCB Part Number: C22775; Power Rating: 100mW; Category: Resistors; Package Size: 0603; JLCPCB Basic Part: Yes; Tolerance: ±1%; Voltage Rating: 75V; Temperature Coefficient: ±200ppm/℃; Temperature Rating: -55℃~+155℃; ComponentLink1Description: Datasheet; ComponentLink1URL: https://wmsc.lcsc.com/wmsc/upload/file/pdf/v2/lcsc/2206010130_UNI-ROYAL-Uniroyal-Elec-0603WAF1000T5E_C22775.pdf; ComponentLink2Description: JLCPCB Part URL; ComponentLink2URL: https://jlcpcb.com/partdetail/C22775
SW1 = CMP-07427-000009-1: SWITCH TACTILE SPST-NO 0.1A 16V; Switch Function: Off-Mom; Throw Configuration: SPST; Max Current Rating: 100mA; Illumination Type: Non-Illuminated; Actuator Type: Standard; Operating Force: 2.94N; Mechanical Life: 100000Cycles; Actuator Material: Rubber; Series: 7914; Orientation: Straight; Max Operating Temperature: 125°C; Case/Package: SMD/SMT; Length: 5mm; Contact Plating: Silver; Depth: 5mm; Min Operating Temperature: -55°C; RoHS Compliant: Yes; Current Rating: 100mA; Contact Material: Gold; Packaging: Tape and Reel; Max Voltage Rating (DC): 16V; Termination: J-Hook; Voltage Rating (DC): 16V; Mount: Surface Mount; Package Quantity: 1
SW2 = CMP-10038-000010-1: SWITCH SLIDE SPDT 300MA 6V; Electrical Life: 5000Cycles; Switch Function: On-On; Actuator Material: Nylon; Actuator Length: 2mm; Actuator Type: Standard; Current Rating: 300mA; Voltage Rating (DC): 6V; Min Operating Temperature: -40°C; Throw Configuration: SPDT; Mount: Surface Mount; Switch Travel: 2mm; Max Operating Temperature: 85°C; Packaging: Cut Tape; Contact Plating: Silver; Contact Material: Copper Alloy

## Sheet MCU-io.SchDoc
size A; SheetNumber: 5; SheetTotal: 7
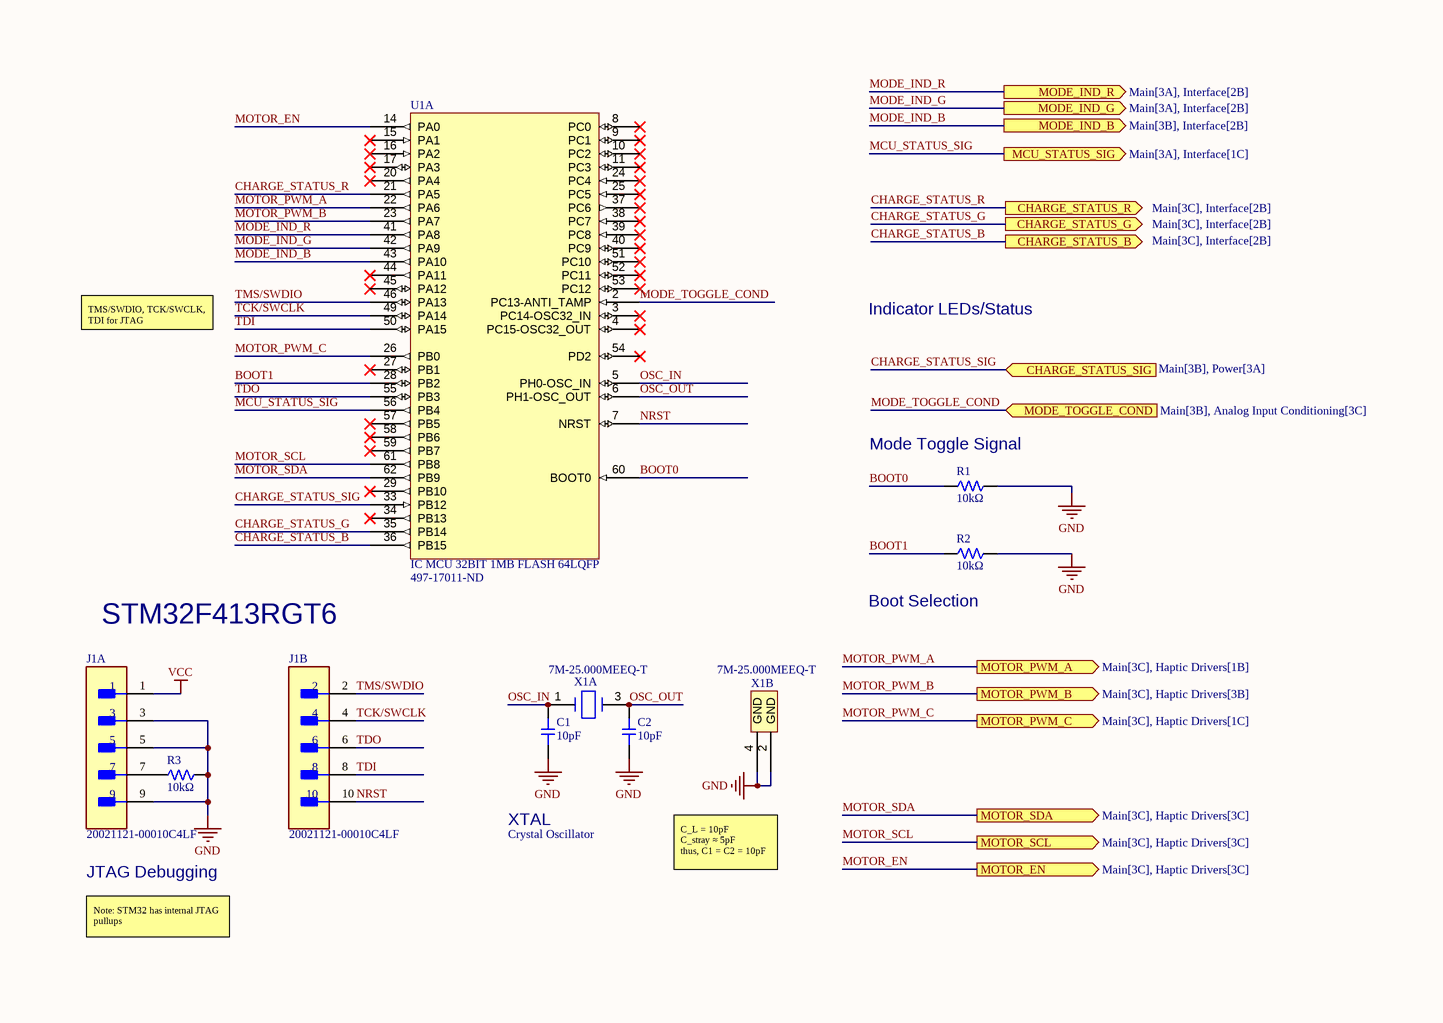
[diagram p5: MCU-io.SchDoc]

### Parts
C1  Capacitance: 10pF  [CAP-0603]  (hidden comment: CL10C100JB8NNNC)
C2  Capacitance: 10pF  [CAP-0603]  (hidden comment: CL10C100JB8NNNC)
J1  20021121-00010C4LF  [FP-20021121-00010C4LF-MFG]  (parts A,B of 2)
R1  Resistance: 10kΩ  [RES-0603]  (hidden comment: 0603WAF1002T5E)
R2  Resistance: 10kΩ  [RES-0603]  (hidden comment: 0603WAF1002T5E)
R3  Resistance: 10kΩ  [RES-0603]  (hidden comment: 0603WAF1002T5E)
U1  IC MCU 32BIT 1MB FLASH 64LQFP  Supplier Part Number 1: 497-17011-ND  [LQFP64-10x10mm]  (part A of 2)
X1  7M-25.000MEEQ-T  [OSCSC320X250X100N]  (parts A,B of 2)

### Ports
CHARGE_STATUS_B (out, see Main[3C], Interface[2B]), CHARGE_STATUS_G (out, see Main[3C], Interface[2B]), CHARGE_STATUS_R (out, see Main[3C], Interface[2B]), CHARGE_STATUS_SIG (in, see Main[3B], Power[3A]), MCU_STATUS_SIG (out, see Main[3A], Interface[1C]), MODE_IND_B (out, see Main[3B], Interface[2B]), MODE_IND_G (out, see Main[3A], Interface[2B]), MODE_IND_R (out, see Main[3A], Interface[2B]), MODE_TOGGLE_COND (in, see Main[3B], Analog Input Conditioning[3C]), MOTOR_EN (out, see Main[3C], Haptic Drivers[3C]), MOTOR_PWM_A (out, see Main[3C], Haptic Drivers[1B]), MOTOR_PWM_B (out, see Main[3C], Haptic Drivers[3B]), MOTOR_PWM_C (out, see Main[3C], Haptic Drivers[1C]), MOTOR_SCL (out, see Main[3C], Haptic Drivers[3C]), MOTOR_SDA (out, see Main[3C], Haptic Drivers[3C])

### Nets
GND: C1.1 C2.1 J1.3 J1.5 J1.9 R1.2 R2.2 R3.2 X1.2(GND) X1.4(GND)
VCC: J1.1
BOOT0: R1.1 U1.60(BOOT0)
BOOT1: R2.1 U1.28(PB2)
CHARGE_STATUS_B: U1.36(PB15) ; port CHARGE_STATUS_B
CHARGE_STATUS_G: U1.35(PB14) ; port CHARGE_STATUS_G
CHARGE_STATUS_R: U1.21(PA5) ; port CHARGE_STATUS_R
CHARGE_STATUS_SIG: U1.33(PB12) ; port CHARGE_STATUS_SIG  [project net CHARGE_STATUS]
MCU_STATUS_SIG: U1.56(PB4) ; port MCU_STATUS_SIG
MODE_IND_B: U1.43(PA10) ; port MODE_IND_B
MODE_IND_G: U1.42(PA9) ; port MODE_IND_G
MODE_IND_R: U1.41(PA8) ; port MODE_IND_R
MODE_TOGGLE_COND: U1.2(PC13-ANTI_TAMP) ; port MODE_TOGGLE_COND
MOTOR_EN: U1.14(PA0) ; port MOTOR_EN
MOTOR_PWM_A: U1.22(PA6) ; port MOTOR_PWM_A
MOTOR_PWM_B: U1.23(PA7) ; port MOTOR_PWM_B
MOTOR_PWM_C: U1.26(PB0) ; port MOTOR_PWM_C
MOTOR_SCL: U1.61(PB8) ; port MOTOR_SCL
MOTOR_SDA: U1.62(PB9) ; port MOTOR_SDA
NRST: J1.10 U1.7(NRST)
OSC_IN: C1.2 U1.5(PH0-OSC_IN) X1.1
OSC_OUT: C2.2 U1.6(PH1-OSC_OUT) X1.3
TCK/SWCLK: J1.4 U1.49(PA14)
TDI: J1.8 U1.50(PA15)
TDO: J1.6 U1.55(PB3)
TMS/SWDIO: J1.2 U1.46(PA13)
NetJ1_7: J1.7 R3.1

Not connected (* = marked no-connect by the designer): U1 3(PC14-OSC32_IN)* 4(PC15-OSC32_OUT)* 8(PC0)* 9(PC1)* 10(PC2)* 11(PC3)* 15(PA1)* 16(PA2)* 17(PA3)* 20(PA4)* 24(PC4)* 25(PC5)* 27(PB1)* 29(PB10)* 34(PB13)* 37(PC6)* 38(PC7)* 39(PC8)* 40(PC9)* 44(PA11)* 45(PA12)* 51(PC10)* 52(PC11)* 53(PC12)* 54(PD2)* 57(PB5)* 58(PB6)* 59(PB7)*

### Notes on the sheet
- TMS/SWDIO, TCK/SWCLK, TDI for JTAG
- Indicator LEDs/Status
- (near R1) Mode Toggle Signal
- STM32F413RGT6
- (near R2) Boot Selection
- XTAL
- Crystal Oscillator
- JTAG Debugging
- C_L = 10pF
  C_stray ≈ 5pF
  thus, C1 = C2 = 10pF
- Note: STM32 has internal JTAG pullups

### Library data of the parts
C1 C2 = CL10C100JB8NNNC: Capacitor, Ceramic (MLCC), 10pF, ±5%, 50V, C0G, ±5%, SMD 0603; Manufacturer: Samsung Electro-Mechanics; Temperature Rating: -55°C ~ 125°C; Impedance (0V Bias) @ 100MHz: 159Ω; Impedance (0V Bias) @ 500MHz: 30.3Ω; Impedance (0V Bias) @ 1GHz: 12.8Ω; Impedance (0V Bias) @ 2GHz: 1.36Ω; Impedance (0V Bias) @ 5GHz: 12.1Ω; Package Size: 0603; JLCPCB Basic Part: Yes; JLCPCB Part Number: C1634; Supplier 1: LCSC; Category: Capacitors - MLCC; Supplier Part Number 1: C1634; Manufacturer Part Number: CL10C100JB8NNNC; Tolerance: ±5%; Voltage Rating: 50V; Temperature Coefficient: C0G; RoHS: Yes; ComponentLink1Description: Datasheet; ComponentLink1URL: https://wmsc.lcsc.com/wmsc/upload/file/pdf/v2/lcsc/2304140030_Samsung-Electro-Mechanics-CL10C100JB8NNNC_C1634.pdf; ComponentLink2Description: JLCPCB Part URL; ComponentLink2URL: https://jlcpcb.com/partdetail/C1634; ComponentLink3Description: LCSC Part URL; ComponentLink3URL: https://lcsc.com/product-detail/Multilayer-Ceramic-Capacitors-MLCC---SMD-SMT_Samsung-Electro-Mechanics-Samsung-Electro-Mechanics-CL10C100JB8NNNC_C1634.html; ComponentLink4Description: Samsung Component Library; ComponentLink4URL: https://weblib.samsungsem.com/mlcc/mlcc-ec.do?partNumber=CL10C100JB8NNN
J1 = CMP-15126-126517171-1: 20021121-00010C4LF Conn Unshrouded Header HDR 10 POS 1.27mm Solder ST Top Entry SMD Minitek127® T/R; Current Rating: 1A; Voltage Rating: 125V; Number of Contacts: 10; Connector Type: Header, Male Pin; Mating Post Length: 3.05mm; Insulation Resistance: 100MΩ; Gender: Male; Contact Resistance: 30mΩ; Stack Height: 3mm; Contact Material: Copper, Gold; Housing Material: Thermoplastic; Number of Pins: 10; Length: 6.35mm; Housing Color: Black; RoHS: Compliant; Max Operating Temperature: 85°C; Min Operating Temperature: -55°C; NexarPartId: 126517171; Mount: Surface Mount; Row Spacing: 1.27mm; Contact Mating Length: 3.048mm; Max Voltage Rating (AC): 125V; Color: Black; Number of Rows: 2; Orientation: Straight; Contact Plating: Gold; Depth: 3.4mm; Pitch: 1.27mm; Height: 4.8mm; Termination: Solder; Radiation Hardening: No; Number of Positions: 10; REACH SVHC: No SVHC
R1-R3 = 0603WAF1002T5E: as R4 on sheet Analog Input Conditioning; Supplier 1: LCSC; Manufacturer Part Number: 0603WAF1002T5E; Supplier Part Number 1: C25804; JLCPCB Part Number: C25804; Power Rating: 100mW; Category: Resistors; Package Size: 0603; JLCPCB Basic Part: Yes; Tolerance: ±1%; Voltage Rating: 75V; Temperature Coefficient: ±100ppm/℃; Temperature Rating: -55℃~+155℃; ComponentLink1Description: Datasheet; ComponentLink1URL: https://wmsc.lcsc.com/wmsc/upload/file/pdf/v2/lcsc/2206010045_UNI-ROYAL-Uniroyal-Elec-0603WAF1002T5E_C25804.pdf; ComponentLink2Description: JLCPCB Part URL; ComponentLink2URL: https://jlcpcb.com/partdetail/C25804
U1 = STM32F4xxR2_minimalist: as U1 on sheet MCU-power; Manufacturer_Part_Number: stm32f4xxr2; Copyright: Copyright (C) 2016 Accelerated Designs. All rights reserved; RefDes: RefDes; Type: Type; Value: Value; Supplier 1: Digi-Key
X1 = 7M-25.000MEEQ-T: CRYSTAL 25.0000MHZ 10PF SMD; Manufacturer 1: TXC; Frequency: 25MHz; Frequency Tolerance: 10ppm; ESR (Equivalent Series Resistance): 60R; Supplier 1: Digi-Key; Supplier Part Number 1: 887-1326-1-ND; Manufacturer Part Number 1: 7M-25.000MEEQ-T; Stock 1: 17097; Pricing 1: 1=1.27, 10=1.209, 50=1.1812, 100=1.0125, 500=0.9844, 1000=0.8297 (USD); Mount: Surface Mount; Case/Package: SMD/SMT; Number of Pins: 4; Min Operating Temperature: -20°C; Max Operating Temperature: 70°C; Load Capacitance: 10pF; Packaging: Tape and Reel; Package Quantity: 3000; Tolerance: 10ppm; Frequency Stability: 10ppm; Termination: SMD/SMT; Length: 3.2mm; Height: 0.031inch; Width: 0.098inch; Depth: 2.5mm; REACH SVHC: No SVHC; ComponentLink1URL: https://datasheet.ciiva.com/26918/getdatasheetpartid-757227-26918816.pdf; ComponentLink1Description: https://datasheet.ciiva.com/26918/getdatasheetpartid-757227-26918816.pdf; ComponentLink2URL: https://datasheet.ciiva.com/856/7m-accuracy-856022.pdf; ComponentLink2Description: https://datasheet.ciiva.com/856/7m-accuracy-856022.pdf; ComponentLink3URL: https://datasheet.ciiva.com/22658/1794111-22658486.pdf; ComponentLink3Description: https://datasheet.ciiva.com/22658/1794111-22658486.pdf; ComponentLink4URL: https://datasheet.ciiva.com/856/7m-accuracy-856023.pdf; ComponentLink4Description: https://datasheet.ciiva.com/856/7m-accuracy-856023.pdf; ComponentLink5URL: https://datasheet.ciiva.com/856/7m-accuracy-856024.pdf; ComponentLink5Description: https://datasheet.ciiva.com/856/7m-accuracy-856024.pdf; ComponentLink6URL: https://datasheet.ciiva.com/4946/7m-11184-4946126.pdf; ComponentLink6Description: https://datasheet.ciiva.com/4946/7m-11184-4946126.pdf; ComponentLink7URL: https://datasheet.ciiva.com/28498/1794111-28498878.pdf; ComponentLink7Description: https://datasheet.ciiva.com/28498/1794111-28498878.pdf

## Sheet Haptic Drivers.SchDoc
size A; SheetNumber: 7; SheetTotal: 7
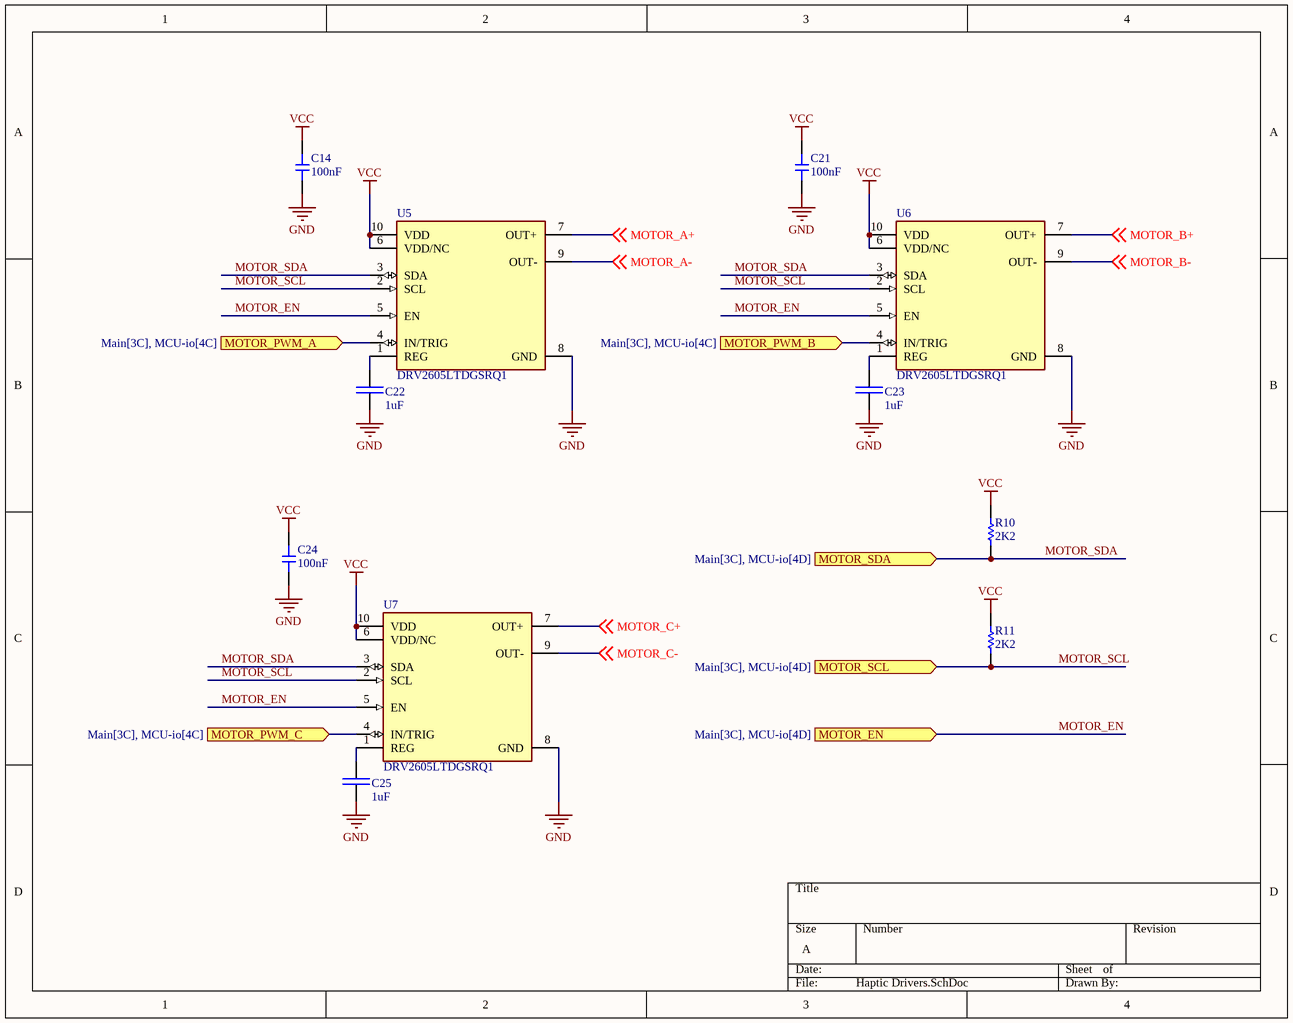
[diagram p6: Haptic Drivers.SchDoc]

### Parts
C14  Capacitance: 100nF  [CAP-0603]  (hidden comment: CC0603KRX7R9BB104)
C21  Capacitance: 100nF  [CAP-0603]  (hidden comment: CC0603KRX7R9BB104)
C22  1uF  [CAP_SM0603_YAGEOCC2_N]
C23  1uF  [CAP_SM0603_YAGEOCC2_N]
C24  Capacitance: 100nF  [CAP-0603]  (hidden comment: CC0603KRX7R9BB104)
C25  1uF  [CAP_SM0603_YAGEOCC2_N]
R10  2K2  [RES_SM0603_YAGEORC_N]
R11  2K2  [RES_SM0603_YAGEORC_N]
U5  DRV2605LTDGSRQ1  [FP-DGS0010A-IPC_B]
U6  DRV2605LTDGSRQ1  [FP-DGS0010A-IPC_B]
U7  DRV2605LTDGSRQ1  [FP-DGS0010A-IPC_B]

### Ports
MOTOR_EN (in, see Main[3C], MCU-io[4D]), MOTOR_PWM_A (in, see Main[3C], MCU-io[4C]), MOTOR_PWM_B (in, see Main[3C], MCU-io[4C]), MOTOR_PWM_C (in, see Main[3C], MCU-io[4C]), MOTOR_SCL (in, see Main[3C], MCU-io[4D]), MOTOR_SDA (in, see Main[3C], MCU-io[4D])

### Nets
GND: C14.1 C21.1 C22.2 C23.2 C24.1 C25.2 U5.8(GND) U6.8(GND) U7.8(GND)
VCC: C14.2 C21.2 C24.2 R10.2 R11.2 U5.6(VDD/NC) U5.10(VDD) U6.6(VDD/NC) U6.10(VDD) U7.6(VDD/NC) U7.10(VDD)
MOTOR_A+: U5.7(OUT+) ; off-sheet MOTOR_A+
MOTOR_A-: U5.9(OUT-) ; off-sheet MOTOR_A-
MOTOR_B+: U6.7(OUT+) ; off-sheet MOTOR_B+
MOTOR_B-: U6.9(OUT-) ; off-sheet MOTOR_B-
MOTOR_C+: U7.7(OUT+) ; off-sheet MOTOR_C+
MOTOR_C-: U7.9(OUT-) ; off-sheet MOTOR_C-
MOTOR_EN: U5.5(EN) U6.5(EN) U7.5(EN) ; port MOTOR_EN
MOTOR_PWM_A: U5.4(IN/TRIG) ; port MOTOR_PWM_A
MOTOR_PWM_B: U6.4(IN/TRIG) ; port MOTOR_PWM_B
MOTOR_PWM_C: U7.4(IN/TRIG) ; port MOTOR_PWM_C
MOTOR_SCL: R11.1 U5.2(SCL) U6.2(SCL) U7.2(SCL) ; port MOTOR_SCL
MOTOR_SDA: R10.1 U5.3(SDA) U6.3(SDA) U7.3(SDA) ; port MOTOR_SDA
NetC22_1: C22.1 U5.1(REG)
NetC23_1: C23.1 U6.1(REG)
NetC25_1: C25.1 U7.1(REG)

### Library data of the parts
C14 C21 C24 = CC0603KRX7R9BB104: as C4 on sheet MCU-power; Package Size: 0603; JLCPCB Basic Part: Yes; JLCPCB Part Number: C14663; Supplier 1: LCSC; Category: Capacitors - MLCC; Supplier Part Number 1: C14663; Manufacturer Part Number: CC0603KRX7R9BB104; Tolerance: ±10%; Voltage Rating: 50V; Temperature Coefficient: X7R; RoHS: Yes; ComponentLink1Description: Datasheet; ComponentLink1URL: https://wmsc.lcsc.com/wmsc/upload/file/pdf/v2/lcsc/2211101700_YAGEO-CC0603KRX7R9BB104_C14663.pdf; ComponentLink2Description: JLCPCB Part URL; ComponentLink2URL: https://jlcpcb.com/partdetail/C14663; ComponentLink3Description: LCSC Part URL; ComponentLink3URL: https://lcsc.com/product-detail/Multilayer-Ceramic-Capacitors-MLCC---SMD-SMT_YAGEO-YAGEO-CC0603KRX7R9BB104_C14663.html
C22 C23 C25 = CC0603KRX7R9BB105: CAP 1uF SM0603 X7R 50V YAGEO CC2; Manufacturer Part Number: CC0603KRX7R9BB183; Tolerance (%): 10; Voltage Rating (Volts): 50; Category: Capacitor; Manufacturer: Yageo; Package: 0603; Value: 1uF; Supplier Part Number 1: 3019743; Supplier 1: Farnell; ComponentLink1URL: http://www.yageo.com; ComponentLink1Description: Manufacturer Website; Supplier 2: Digi-Key
R10 R11 = RC0603FR-072K2L: RES 2K2 SM0603 YAGEO RC_L; Power (Watts): 0.1; Resistance (Ohms): 2200; Tolerance (%): 1; Category: Resistor; Manufacturer: Yageo; Manufacturer Part Number: RC0603FR-072K2L; Package: 0603; Value: 2K2; Supplier Part Number 1: 9238522; Supplier 1: Farnell; ComponentLink1URL: http://www.yageo.com; ComponentLink1Description: Manufacturer Website; Supplier 2: Digi-Key; Supplier Part Number 2: 311-2.20KHRCT-ND
U5-U7 = CMP-04915-000035-1: IC MOTOR DRIVER 2V-5.2V 10VSSOP; Logic Function: AND GATE; Min Supply Voltage: 2V; Max Supply Voltage: 5.2V; Quiescent Current: 500uA; Interface: I2C; Min Operating Temperature: -40°C; RoHS Compliant: Yes; Max Operating Temperature: 105°C; Case/Package: VSSOP; REACH SVHC: No SVHC; Packaging: Cut Tape; Number of Pins: 10; Mount: Surface Mount; Lead Free: Lead Free

## Nets that join several sheets
GND: MCU-power (14 pins), Power (12 pins), Analog Input Conditioning (C12.1 C13.1 D1.1 U2.4), Interface (D5.1 SW1.2_1-), MCU-io (10 pins), Haptic Drivers (9 pins)
VCC: MCU-power (14 pins), Power (R9.2), Analog Input Conditioning (C12.2 D1.2 U2.8), Interface (D2.4 D3.4 R8.2 SW2.1), MCU-io (J1.1), Haptic Drivers (11 pins)
CHARGE_STATUS: Power (R6.2 R9.1 U3.1), MCU-io (U1.33)
CHARGE_STATUS_B: Interface (R19.2), MCU-io (U1.36)
CHARGE_STATUS_G: Interface (R18.2), MCU-io (U1.35)
CHARGE_STATUS_R: Interface (R17.2), MCU-io (U1.21)
MCU_STATUS_SIG: Interface (R14.1), MCU-io (U1.56)
MODE_IND_B: Interface (R16.2), MCU-io (U1.43)
MODE_IND_G: Interface (R15.2), MCU-io (U1.42)
MODE_IND_R: Interface (R12.2), MCU-io (U1.41)
MODE_TOGGLE_COND: Analog Input Conditioning (U2.6 U2.7), MCU-io (U1.2)
MOTOR_EN: MCU-io (U1.14), Haptic Drivers (U5.5 U6.5 U7.5)
MOTOR_PWM_A: MCU-io (U1.22), Haptic Drivers (U5.4)
MOTOR_PWM_B: MCU-io (U1.23), Haptic Drivers (U6.4)
MOTOR_PWM_C: MCU-io (U1.26), Haptic Drivers (U7.4)
MOTOR_SCL: MCU-io (U1.61), Haptic Drivers (R11.1 U5.2 U6.2 U7.2)
MOTOR_SDA: MCU-io (U1.62), Haptic Drivers (R10.1 U5.3 U6.3 U7.3)
NetC17_2: Power (C17.2 C18.2 C19.2 U4.5), Interface (SW2.2)
NetR4_1: Analog Input Conditioning (R4.1), Interface (R8.1 SW1.1_2+)